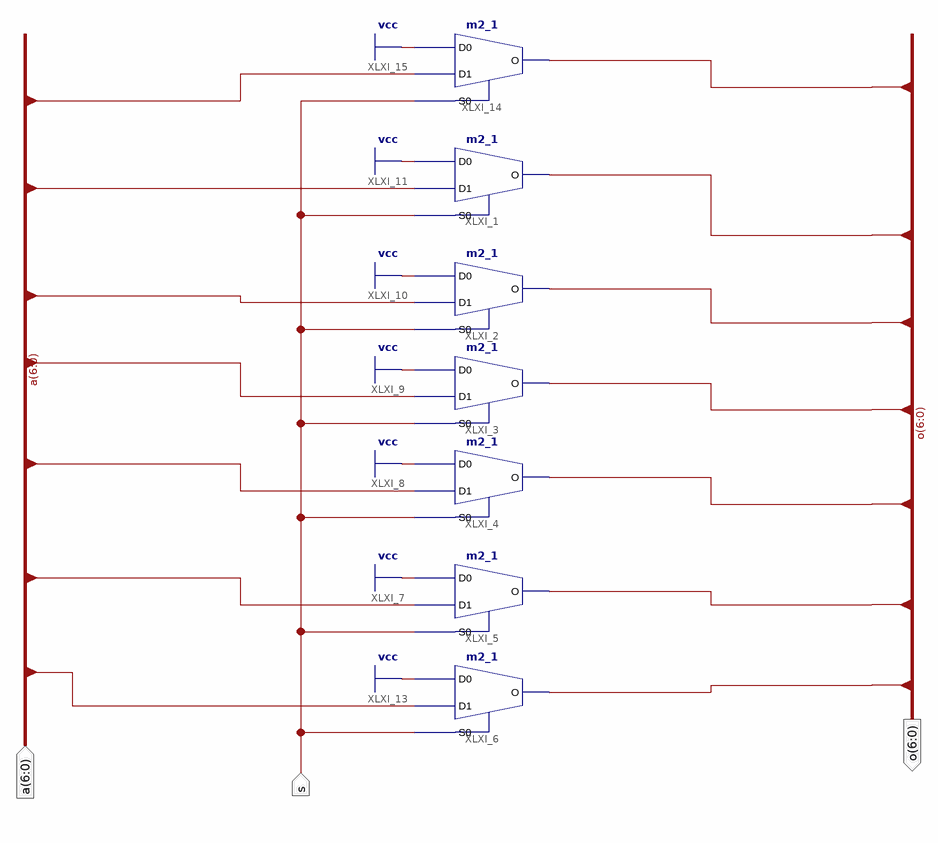
[diagram p0: schematic sheet 1]
// Xilinx ISE schematic empty_design.sch (spartan3) as structural Verilog: 7 symbols, 3 ports
module empty_design (
  input  s,
  input  [6:0] a,
  output [6:0] o
);

  m2_1 XLXI_1 (.D0(1'b1), .D1(a[5]), .S0(s), .O(o[5]));
  m2_1 XLXI_2 (.D0(1'b1), .D1(a[4]), .S0(s), .O(o[4]));
  m2_1 XLXI_3 (.D0(1'b1), .D1(a[3]), .S0(s), .O(o[3]));
  m2_1 XLXI_4 (.D0(1'b1), .D1(a[2]), .S0(s), .O(o[2]));
  m2_1 XLXI_5 (.D0(1'b1), .D1(a[1]), .S0(s), .O(o[1]));
  m2_1 XLXI_6 (.D0(1'b1), .D1(a[0]), .S0(s), .O(o[0]));
  m2_1 XLXI_14 (.D0(1'b1), .D1(a[6]), .S0(s), .O(o[6]));
endmodule
